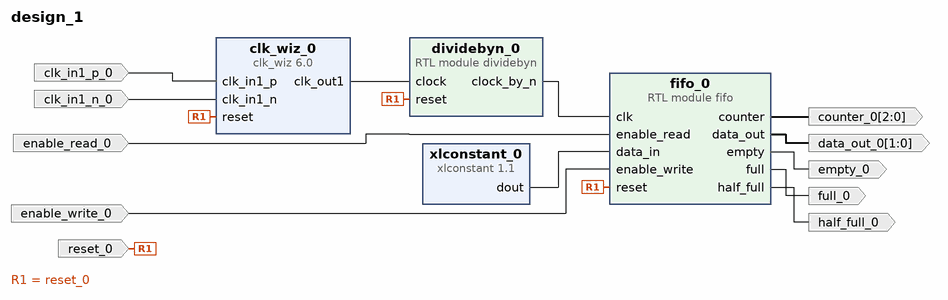
[diagram p0: block diagram of the top level]
# Vivado block design design_1, xc7z045ffg900-2, Vivado 2019.1
create_bd_design design_1

create_bd_port -dir I -type clk clk_in1_p_0
set_property -dict {CONFIG.FREQ_HZ 200000000} [get_bd_ports clk_in1_p_0]
create_bd_port -dir I -type clk clk_in1_n_0
set_property -dict {CONFIG.FREQ_HZ 200000000} [get_bd_ports clk_in1_n_0]
create_bd_port -dir I enable_read_0
create_bd_port -dir I enable_write_0
create_bd_port -dir O -from 1 -to 0 data_out_0
create_bd_port -dir O empty_0
create_bd_port -dir O full_0
create_bd_port -dir O half_full_0
create_bd_port -dir O -from 2 -to 0 counter_0
create_bd_port -dir I -type rst reset_0
set_property -dict {CONFIG.POLARITY ACTIVE_HIGH} [get_bd_ports reset_0]

create_bd_cell -type ip -vlnv xilinx.com:ip:clk_wiz:6.0 clk_wiz_0
set_property -dict [list \
  CONFIG.CLKIN1_JITTER_PS 50.0 \
  CONFIG.CLKOUT1_DRIVES BUFG \
  CONFIG.CLKOUT1_JITTER 431.198 \
  CONFIG.CLKOUT1_PHASE_ERROR 313.282 \
  CONFIG.CLKOUT1_REQUESTED_OUT_FREQ 10.000 \
  CONFIG.CLKOUT2_DRIVES BUFG \
  CONFIG.CLKOUT3_DRIVES BUFG \
  CONFIG.CLKOUT4_DRIVES BUFG \
  CONFIG.CLKOUT5_DRIVES BUFG \
  CONFIG.CLKOUT6_DRIVES BUFG \
  CONFIG.CLKOUT7_DRIVES BUFG \
  CONFIG.MMCM_BANDWIDTH OPTIMIZED \
  CONFIG.MMCM_CLKFBOUT_MULT_F 41 \
  CONFIG.MMCM_CLKIN1_PERIOD 5.000 \
  CONFIG.MMCM_CLKIN2_PERIOD 10.0 \
  CONFIG.MMCM_CLKOUT0_DIVIDE_F 82 \
  CONFIG.MMCM_COMPENSATION ZHOLD \
  CONFIG.MMCM_DIVCLK_DIVIDE 10 \
  CONFIG.PRIMITIVE PLL \
  CONFIG.PRIM_IN_FREQ 200.000 \
  CONFIG.PRIM_SOURCE Differential_clock_capable_pin \
  CONFIG.RESET_PORT reset \
  CONFIG.RESET_TYPE ACTIVE_HIGH \
  CONFIG.USE_LOCKED false \
] [get_bd_cells clk_wiz_0]
create_bd_cell -type module -reference dividebyn dividebyn_0
create_bd_cell -type module -reference fifo fifo_0
create_bd_cell -type ip -vlnv xilinx.com:ip:xlconstant:1.1 xlconstant_0
set_property -dict {CONFIG.CONST_VAL 3 CONFIG.CONST_WIDTH 2} [get_bd_cells xlconstant_0]

# ---- connections ----

connect_bd_net [get_bd_pins clk_wiz_0/clk_out1] [get_bd_pins dividebyn_0/clock]
connect_bd_net [get_bd_pins dividebyn_0/clock_by_n] [get_bd_pins fifo_0/clk]
connect_bd_net -net clk_in1_p_0_1 [get_bd_ports clk_in1_p_0] [get_bd_pins clk_wiz_0/clk_in1_p]
connect_bd_net -net clk_in1_n_0_1 [get_bd_ports clk_in1_n_0] [get_bd_pins clk_wiz_0/clk_in1_n]
connect_bd_net -net enable_read_0_1 [get_bd_ports enable_read_0] [get_bd_pins fifo_0/enable_read]
connect_bd_net -net enable_write_0_1 [get_bd_ports enable_write_0] [get_bd_pins fifo_0/enable_write]
connect_bd_net [get_bd_pins fifo_0/data_out] [get_bd_ports data_out_0]
connect_bd_net [get_bd_pins fifo_0/empty] [get_bd_ports empty_0]
connect_bd_net [get_bd_pins fifo_0/full] [get_bd_ports full_0]
connect_bd_net [get_bd_pins fifo_0/half_full] [get_bd_ports half_full_0]
connect_bd_net [get_bd_pins fifo_0/counter] [get_bd_ports counter_0]
connect_bd_net -net reset_0_1 [get_bd_ports reset_0] [get_bd_pins clk_wiz_0/reset] [get_bd_pins dividebyn_0/reset] [get_bd_pins fifo_0/reset]
connect_bd_net [get_bd_pins xlconstant_0/dout] [get_bd_pins fifo_0/data_in]

validate_bd_design
save_bd_design
